# Altium schematic sheet BUTTONS.SchDoc
size A3; SheetNumber: 7; SheetTotal: 8
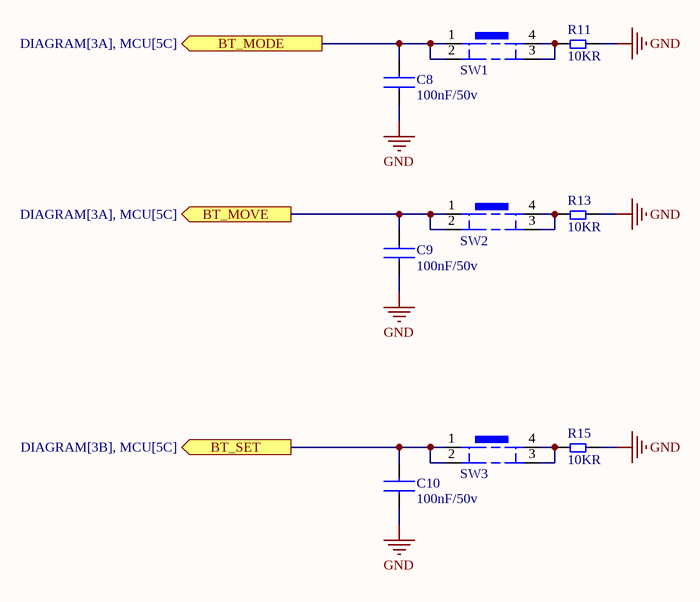
[diagram p0: BUTTONS.SchDoc]

## Parts
C8  100nF/50v  [CAP-CER-0805]
C9  100nF/50v  [CAP-CER-0805]
C10  100nF/50v  [CAP-CER-0805]
R11  10KR  [RES-SMD-0805]
R13  10KR  [RES-SMD-0805]
R15  10KR  [RES-SMD-0805]
SW1  0  [Tactice-Switch-TH-12x12-4.5mm]  (value not drawn)
SW2  0  [Tactice-Switch-TH-12x12-4.5mm]  (value not drawn)
SW3  0  [Tactice-Switch-TH-12x12-4.5mm]  (value not drawn)

## Ports
BT_MODE (out, see DIAGRAM[3A], MCU[5C]), BT_MOVE (out, see DIAGRAM[3A], MCU[5C]), BT_SET (out, see DIAGRAM[3B], MCU[5C])

## Nets
GND: C8.1 C9.1 C10.1 R11.1 R13.1 R15.1
BT_MODE: C8.2 SW1.1 SW1.2 ; port BT_MODE
BT_MOVE: C9.2 SW2.1 SW2.2 ; port BT_MOVE
BT_SET: C10.2 SW3.1 SW3.2 ; port BT_SET
NetR11_2: R11.2 SW1.3 SW1.4
NetR13_2: R13.2 SW2.3 SW2.4
NetR15_2: R15.2 SW3.3 SW3.4

## Library data of the parts
C8-C10 = ID-14: Tụ Gốm 0805 100nF (0.1uF) 50V; Design Item ID: ID-14; Value: 100nF/50v
R11 R13 R15 = ID-4: Điện Trở 10 KOhm 0805 1%; Design Item ID: ID-4; Value: 10KR
SW1-SW3 = ID-18: Nút Nhấn 6x6mm Cao 6mm 4 Chân Xuyên Lỗ; Design Item ID: ID-18